# Altium schematic sheet Supply.SchDoc: Supply
size A4; Author: Andreas Rehn; CompanyName: Hochschule Ulm; DrawnBy: Andreas Rehn; Engineer: Andreas Rehn; Organization: Hochschule Ulm; Address1: Institut für Medizintechnik; Address2: und Mechatronik; Address3: Albert-Einstein-Allee 55; Address4: 89081 Ulm; SheetNumber: 3; SheetTotal: 11
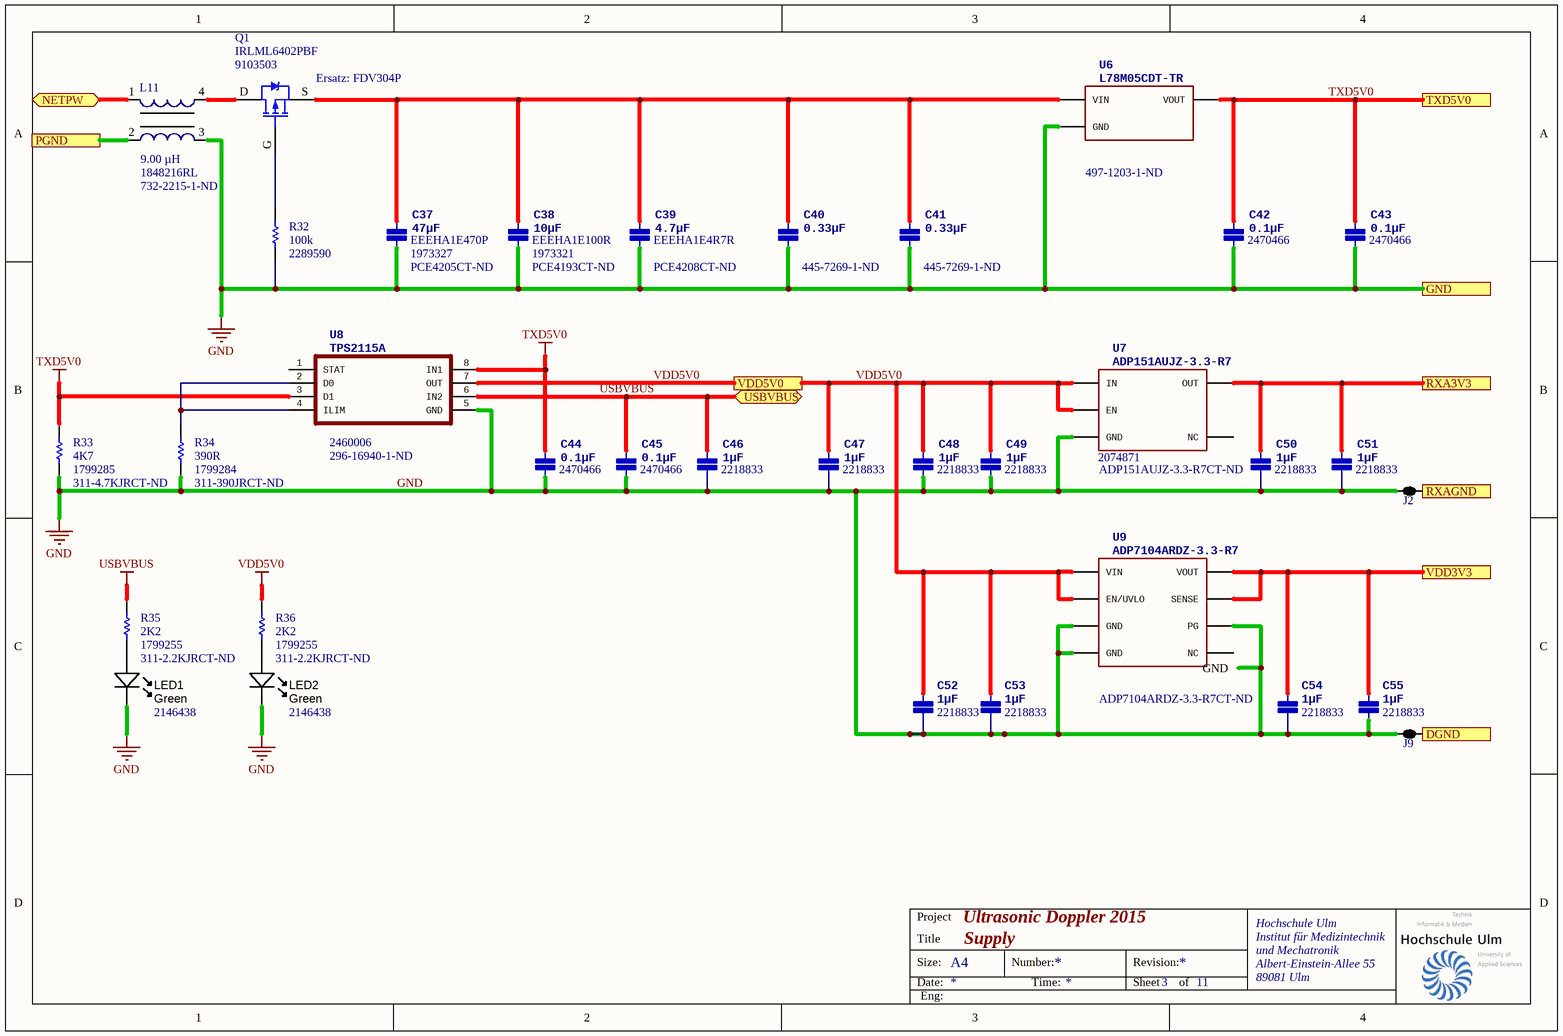
[diagram p0: Supply.SchDoc]

## Parts
C37  47µF  PartNr.: EEEHA1E470P  Supplier Part Number 1: 1973327  Supplier Part Number 2: PCE4205CT-ND  [Panasonic Size E]
C38  10µF  PartNr.: EEEHA1E100R  Supplier Part Number 1: 1973321  Supplier Part Number 2: PCE4193CT-ND  [Panasonic Size C]
C39  4.7µF  PartNr.: EEEHA1E4R7R  Supplier Part Number 1: PCE4208CT-ND  [Panasonic Size B]
C40  0.33µF  Supplier Part Number 1: 445-7269-1-ND  [0603]
C41  0.33µF  Supplier Part Number 1: 445-7269-1-ND  [0603]
C42  0.1µF  Supplier Part Number 1: 2470466  [0402[1005]]
C43  0.1µF  Supplier Part Number 1: 2470466  [0402[1005]]
C44  0.1µF  Supplier Part Number 1: 2470466  [0402[1005]]
C45  0.1µF  Supplier Part Number 1: 2470466  [0402[1005]]
C46  1µF  Supplier Part Number 1: 2218833  [0402[1005]]
C47  1µF  Supplier Part Number 1: 2218833  [0402[1005]]
C48  1µF  Supplier Part Number 1: 2218833  [0402[1005]]
C49  1µF  Supplier Part Number 1: 2218833  [0402[1005]]
C50  1µF  Supplier Part Number 1: 2218833  [0402[1005]]
C51  1µF  Supplier Part Number 1: 2218833  [0402[1005]]
C52  1µF  Supplier Part Number 1: 2218833  [0402[1005]]
C53  1µF  Supplier Part Number 1: 2218833  [0402[1005]]
C54  1µF  Supplier Part Number 1: 2218833  [0402[1005]]
C55  1µF  Supplier Part Number 1: 2218833  [0402[1005]]
J2  2 way net tie junction  [2way_MP]  (value not drawn)  (net tie, no BOM)
J9  2 way net tie junction  [2way_MP]  (value not drawn)  (net tie, no BOM)
L11  9.00 µH  Supplier Part Number 1: 1848216RL  Supplier Part Number 2: 732-2215-1-ND  [WE-SL5 HC]
LED1  Green  Supplier Part Number 1: 2146438  [LED-0603-GREEN]
LED2  Green  Supplier Part Number 1: 2146438  [LED-0603-GREEN]
Q1  IRLML6402PBF  Supplier Part Number 1: 9103503  [SOT23-3]
R32  100k  Supplier Part Number 1: 2289590  [0402[1005]]
R33  4K7  Supplier Part Number 1: 311-4.7KJRCT-ND  Supplier Part Number 2: 1799285  [0402[1005]]
R34  390R  Supplier Part Number 1: 1799284  Supplier Part Number 2: 311-390JRCT-ND  [0402[1005]]
R35  2K2  Supplier Part Number 1: 311-2.2KJRCT-ND  Supplier Part Number 2: 1799255  [0402[1005]]
R36  2K2  Supplier Part Number 1: 311-2.2KJRCT-ND  Supplier Part Number 2: 1799255  [0402[1005]]
U6  L78M05CDT-TR  Supplier Part Number 1: 497-1203-1-ND  [DPAK]
U7  ADP151AUJZ-3.3-R7  Supplier Part Number 1: 2074871  Supplier Part Number 2: ADP151AUJZ-3.3-R7CT-ND  [SOT23-5-TI]
U8  TPS2115A  Supplier Part Number 1: 2460006  Supplier Part Number 2: 296-16940-1-ND  [TSSOP-8]
U9  ADP7104ARDZ-3.3-R7  Supplier Part Number 1: ADP7104ARDZ-3.3-R7CT-ND  [SOIC8_EP]

## Ports
DGND, GND, NETPW, PGND, RXA3V3, RXAGND, TXD5V0, USBVBUS (bidir), VDD3V3, VDD5V0

## Nets
GND: C37.2(P$2) C38.2(P$2) C39.2(P$2) C40.2(P$2) C41.2(P$2) C42.2(P$2) C43.2(P$2) C44.2(P$2) C45.2(P$2) C46.2(P$2) C47.2(P$2) C48.2(P$2) C49.2(P$2) C50.2(P$2) C51.2(P$2) C52.2(P$2) C53.2(P$2) C54.2(P$2) C55.2(P$2) J2.1 J9.1 L11.3 LED1.K LED2.K R32.2 R33.2 R34.2 U6.GND U7.2(GND) U8.5(GND) U9.3(GND) U9.6(GND) U9.7(PG) U9.9(GND) ; port GND
TXD5V0: C42.1(P$1) C43.1(P$1) C44.1(P$1) R33.1 U6.VOUT U8.3(D1) U8.8(IN1) ; port TXD5V0
USBVBUS: C45.1(P$1) C46.1(P$1) R35.1 U8.6(IN2) ; port USBVBUS
VDD5V0: C47.1(P$1) C48.1(P$1) C49.1(P$1) C52.1(P$1) C53.1(P$1) R36.1 U7.1(IN) U7.3(EN) U8.7(OUT) U9.5(EN/UVLO) U9.8(VIN) ; port VDD5V0
DGND: J9.2 ; port DGND
NETPW: L11.1 ; port NETPW
PGND: L11.2 ; port PGND
RXA3V3: C50.1(P$1) C51.1(P$1) U7.5(OUT) ; port RXA3V3
RXAGND: J2.2 ; port RXAGND
VDD3V3: C54.1(P$1) C55.1(P$1) U9.1(VOUT) U9.2(SENSE) ; port VDD3V3
NetC37_1: C37.1(P$1) C38.1(P$1) C39.1(P$1) C40.1(P$1) C41.1(P$1) Q1.S U6.VIN
NetL11_4: L11.4 Q1.D
NetLED1_A: LED1.A R35.2
NetLED2_A: LED2.A R36.2
NetQ1_G: Q1.G R32.1
NetR34_1: R34.1 U8.2(D0) U8.4(ILIM)

Not connected (* = marked no-connect by the designer): U7 4(NC); U8 1(STAT); U9 4(NC)

## Notes on the sheet
- (near Q1) Ersatz: FDV304P
- Project
- Ultrasonic Doppler 2015
- Title
- Size:
- Date:
- A4
- Number:
- Time:
- Revision:
- Sheet
- of
- Eng:

## Library data of the parts
C37 = Capacitor: Cap Panasonic Size E; value: 47µF; Supplier 1: Farnell; Supplier 2: Digi-Key
C38 = Capacitor: Cap Panasonic Size C; value: 10µF; Supplier 1: Farnell; Supplier 2: Digi-Key
C39 = Capacitor: Cap Panasonic Size B; value: 4.7µF; Supplier 1: Digi-Key
C40-C55 = Capacitor: Cap
  C40 C41: value: 0.33µF; Supplier 1: Digi-Key
  C42-C45: value: 0.1µF; Supplier 1: Farnell
  C46-C49 C52 C53: value: 1µF; Supplier 1: Farnell
  C50 C51 C54: value: 1µF; Supplier 1: Farnell; ComponentLink1Description: DataSheet; ComponentLink1URL: http://psearch.en.murata.com/capacitor/product/GRM153R61A105ME95%23.pdf
  C55: value: 1µF; ComponentLink1Description: DataSheet; ComponentLink1URL: http://psearch.en.murata.com/capacitor/product/GRM153R61A105ME95%23.pdf; Supplier 1: Farnell
J2 J9 = 2way: ComponentLink1URL: http://www.edatools.cz/addons; ComponentLink1Description: Source; FootprintNote: LP=12mil, MP=40mil, HP=120mil
L11 = WE-SL5 HC, 744273801: SMD Common Mode Line Filter WE-SL5 HC, L=9.00 µH; Manufacturer: Würth Elektronik eiSos GmbH; partNo: 744273801; Inductance: 9.00 µH; ComponentLink1Description: Manufacturer; ComponentLink1URL: http://www.we-online.de; Created by: Christin Zierenner; Created Date: November 2009; ComponentLink2Description: Datasheet; ComponentLink2URL: http://www.we-online.de/katalog/media/pdf/744273801.pdf; Supplier 1: Farnell; Supplier 2: Digi-Key
LED1 LED2 = LED_SMD_Green_0603_525nm_350mcd: LED 0603 SMD Green 525nm 350mcd 20mA; Package / Case: 0603 (1608 metric); Color: Green; Supplier 1: Farnell
Q1 = PMOS-2: P-Channel Power MOSFET; pin to pad: D>3 G>1 S>2; Note: Pin 4 not drawn and electrically connected to Pin 2.; Published: 8-Jun-2000; LatestRevisionDate: 17-Jul-2002; LatestRevisionNote: Re-released for DXP Platform.; DatasheetVersion: PD-9.390D; PackageVersion: Feb-1997; PackageReference: TO-220AB; Publisher: Altium Limited; PackageDescription: TO, Thru-Hole, Vertical, Heatsink Mounted; 3 In-Line Leads; Pitch 2.54 mm; ComponentLink1Description: Manufacturer Link; ComponentLink1URL: http://www.irf.com/; Supplier 1: Farnell; value: IRLML6402PBF; DataSheet: http://www.farnell.com/datasheets/1912232.pdf
R32-R36 = Resistor: Published: 8-Jun-2000; LatestRevisionDate: 17-Jul-2002; LatestRevisionNote: Re-released for DXP Platform.; PackageReference: AXIAL-0.3; Publisher: Altium Limited; PackageDescription: Axial Device, Thru-Hole; 2 Leads; 0.3 in Pin Spacing
  R32: Value: 100k; Supplier 1: Farnell
  R33: Value: 4K7; Supplier 1: Digi-Key; Supplier 2: Farnell
  R34: Value: 390R; Supplier 1: Farnell; Supplier 2: Digi-Key
  R35 R36: Value: 2K2; Supplier 1: Digi-Key; Supplier 2: Farnell
U6 = L78M: Switch mode power supply; pin to pad: GND>4 VIN>1 VOUT>3; IOUT: 500mA; VOUT: 5V; value: L78M05CDT-TR; ComponentLink1URL: http://www.farnell.com/datasheets/1834365.pdf; ComponentLink1Description: DataSheet; Supplier 1: Digi-Key
U7 = ADP151: LDO; value: ADP151AUJZ-3.3-R7; Supplier 1: Farnell; ComponentLink1URL: http://www.analog.com/media/en/technical-documentation/data-sheets/ADP151.pdf; ComponentLink1Description: DataSheet; Supplier 2: Digi-Key
U8 = TPS2115A: autoswitching power mux; Supplier 1: Farnell; value: TPS2115A; DataSheet: http://www.farnell.com/datasheets/1862467.pdf; Supplier 2: Digi-Key
U9 = ADP7104: LDO; value: ADP7104ARDZ-3.3-R7; Supplier 1: Digi-Key; ComponentLink1URL: http://www.analog.com/media/en/technical-documentation/data-sheets/ADP7104.pdf; ComponentLink1Description: DataSheet